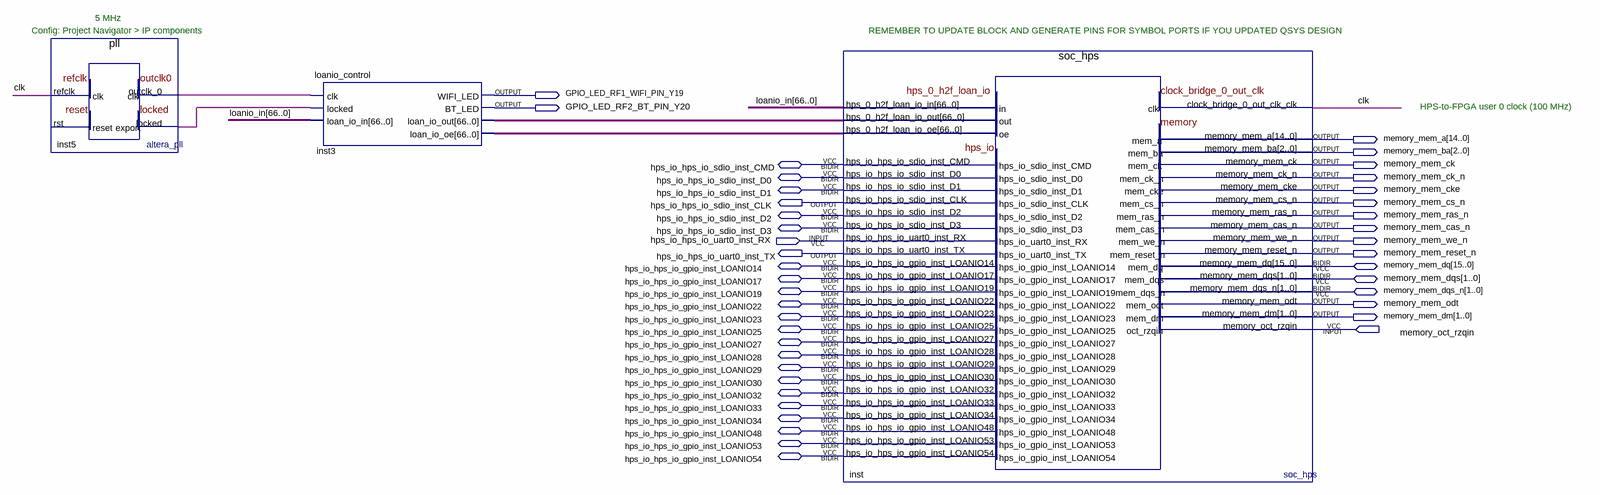
[diagram p0: schematic sheet]
// Quartus schematic main.bdf as structural Verilog: 3 symbols, 42 pins
module main (
  input  hps_io_hps_io_uart0_inst_RX,
  input  memory_oct_rzqin,
  inout  hps_io_hps_io_sdio_inst_CMD,
  inout  hps_io_hps_io_sdio_inst_D0,
  inout  hps_io_hps_io_sdio_inst_D1,
  inout  hps_io_hps_io_sdio_inst_D2,
  inout  hps_io_hps_io_sdio_inst_D3,
  inout  hps_io_hps_io_gpio_inst_LOANIO14,
  inout  [15:0] memory_mem_dq,
  inout  hps_io_hps_io_gpio_inst_LOANIO17,
  inout  [1:0] memory_mem_dqs,
  inout  hps_io_hps_io_gpio_inst_LOANIO19,
  inout  [1:0] memory_mem_dqs_n,
  inout  hps_io_hps_io_gpio_inst_LOANIO22,
  inout  hps_io_hps_io_gpio_inst_LOANIO23,
  inout  hps_io_hps_io_gpio_inst_LOANIO25,
  inout  hps_io_hps_io_gpio_inst_LOANIO27,
  inout  hps_io_hps_io_gpio_inst_LOANIO28,
  inout  hps_io_hps_io_gpio_inst_LOANIO29,
  inout  hps_io_hps_io_gpio_inst_LOANIO30,
  inout  hps_io_hps_io_gpio_inst_LOANIO32,
  inout  hps_io_hps_io_gpio_inst_LOANIO33,
  inout  hps_io_hps_io_gpio_inst_LOANIO34,
  inout  hps_io_hps_io_gpio_inst_LOANIO48,
  inout  hps_io_hps_io_gpio_inst_LOANIO53,
  inout  hps_io_hps_io_gpio_inst_LOANIO54,
  output GPIO_LED_RF1_WIFI_PIN_Y19,
  output GPIO_LED_RF2_BT_PIN_Y20,
  output [14:0] memory_mem_a,
  output [2:0] memory_mem_ba,
  output memory_mem_ck,
  output memory_mem_ck_n,
  output memory_mem_cke,
  output hps_io_hps_io_sdio_inst_CLK,
  output memory_mem_cs_n,
  output memory_mem_ras_n,
  output memory_mem_cas_n,
  output memory_mem_we_n,
  output hps_io_hps_io_uart0_inst_TX,
  output memory_mem_reset_n,
  output memory_mem_odt,
  output [1:0] memory_mem_dm
);

  wire clk, inst5_locked, inst5_outclk_0;
  wire [66:0] inst3_loan_io_oe, inst3_loan_io_out, loanio_in;

  pll inst5 (.refclk(clk), .outclk_0(inst5_outclk_0), .locked(inst5_locked));  // open: rst
  loanio_control inst3 (
    .clk(inst5_outclk_0), .locked(inst5_locked), .loan_io_in(loanio_in),
    .WIFI_LED(GPIO_LED_RF1_WIFI_PIN_Y19), .BT_LED(GPIO_LED_RF2_BT_PIN_Y20), .loan_io_out(inst3_loan_io_out),
    .loan_io_oe(inst3_loan_io_oe));
  soc_hps inst (
    .hps_0_h2f_loan_io_out(inst3_loan_io_out), .hps_0_h2f_loan_io_oe(inst3_loan_io_oe),
    .hps_io_hps_io_uart0_inst_RX(hps_io_hps_io_uart0_inst_RX), .memory_oct_rzqin(memory_oct_rzqin),
    .clock_bridge_0_out_clk_clk(clk), .hps_0_h2f_loan_io_in(loanio_in),
    .hps_io_hps_io_sdio_inst_CLK(hps_io_hps_io_sdio_inst_CLK),
    .hps_io_hps_io_uart0_inst_TX(hps_io_hps_io_uart0_inst_TX), .memory_mem_a(memory_mem_a),
    .memory_mem_ba(memory_mem_ba), .memory_mem_ck(memory_mem_ck), .memory_mem_ck_n(memory_mem_ck_n),
    .memory_mem_cke(memory_mem_cke), .memory_mem_cs_n(memory_mem_cs_n), .memory_mem_ras_n(memory_mem_ras_n),
    .memory_mem_cas_n(memory_mem_cas_n), .memory_mem_we_n(memory_mem_we_n),
    .memory_mem_reset_n(memory_mem_reset_n), .memory_mem_odt(memory_mem_odt), .memory_mem_dm(memory_mem_dm),
    .hps_io_hps_io_sdio_inst_CMD(hps_io_hps_io_sdio_inst_CMD),
    .hps_io_hps_io_sdio_inst_D0(hps_io_hps_io_sdio_inst_D0),
    .hps_io_hps_io_sdio_inst_D1(hps_io_hps_io_sdio_inst_D1),
    .hps_io_hps_io_sdio_inst_D2(hps_io_hps_io_sdio_inst_D2),
    .hps_io_hps_io_sdio_inst_D3(hps_io_hps_io_sdio_inst_D3),
    .hps_io_hps_io_gpio_inst_LOANIO14(hps_io_hps_io_gpio_inst_LOANIO14),
    .hps_io_hps_io_gpio_inst_LOANIO17(hps_io_hps_io_gpio_inst_LOANIO17),
    .hps_io_hps_io_gpio_inst_LOANIO19(hps_io_hps_io_gpio_inst_LOANIO19),
    .hps_io_hps_io_gpio_inst_LOANIO22(hps_io_hps_io_gpio_inst_LOANIO22),
    .hps_io_hps_io_gpio_inst_LOANIO23(hps_io_hps_io_gpio_inst_LOANIO23),
    .hps_io_hps_io_gpio_inst_LOANIO25(hps_io_hps_io_gpio_inst_LOANIO25),
    .hps_io_hps_io_gpio_inst_LOANIO27(hps_io_hps_io_gpio_inst_LOANIO27),
    .hps_io_hps_io_gpio_inst_LOANIO28(hps_io_hps_io_gpio_inst_LOANIO28),
    .hps_io_hps_io_gpio_inst_LOANIO29(hps_io_hps_io_gpio_inst_LOANIO29),
    .hps_io_hps_io_gpio_inst_LOANIO30(hps_io_hps_io_gpio_inst_LOANIO30),
    .hps_io_hps_io_gpio_inst_LOANIO32(hps_io_hps_io_gpio_inst_LOANIO32),
    .hps_io_hps_io_gpio_inst_LOANIO33(hps_io_hps_io_gpio_inst_LOANIO33),
    .hps_io_hps_io_gpio_inst_LOANIO34(hps_io_hps_io_gpio_inst_LOANIO34),
    .hps_io_hps_io_gpio_inst_LOANIO48(hps_io_hps_io_gpio_inst_LOANIO48),
    .hps_io_hps_io_gpio_inst_LOANIO53(hps_io_hps_io_gpio_inst_LOANIO53),
    .hps_io_hps_io_gpio_inst_LOANIO54(hps_io_hps_io_gpio_inst_LOANIO54), .memory_mem_dq(memory_mem_dq),
    .memory_mem_dqs(memory_mem_dqs), .memory_mem_dqs_n(memory_mem_dqs_n));

  // Notes on the sheet:
  //   5 MHz 
  //   Config: Project Navigator > IP components 
  //   REMEMBER TO UPDATE BLOCK AND GENERATE PINS FOR SYMBOL PORTS IF YOU UPDATED QSYS DESIGN
  //   HPS-to-FPGA user 0 clock (100 MHz)
endmodule
